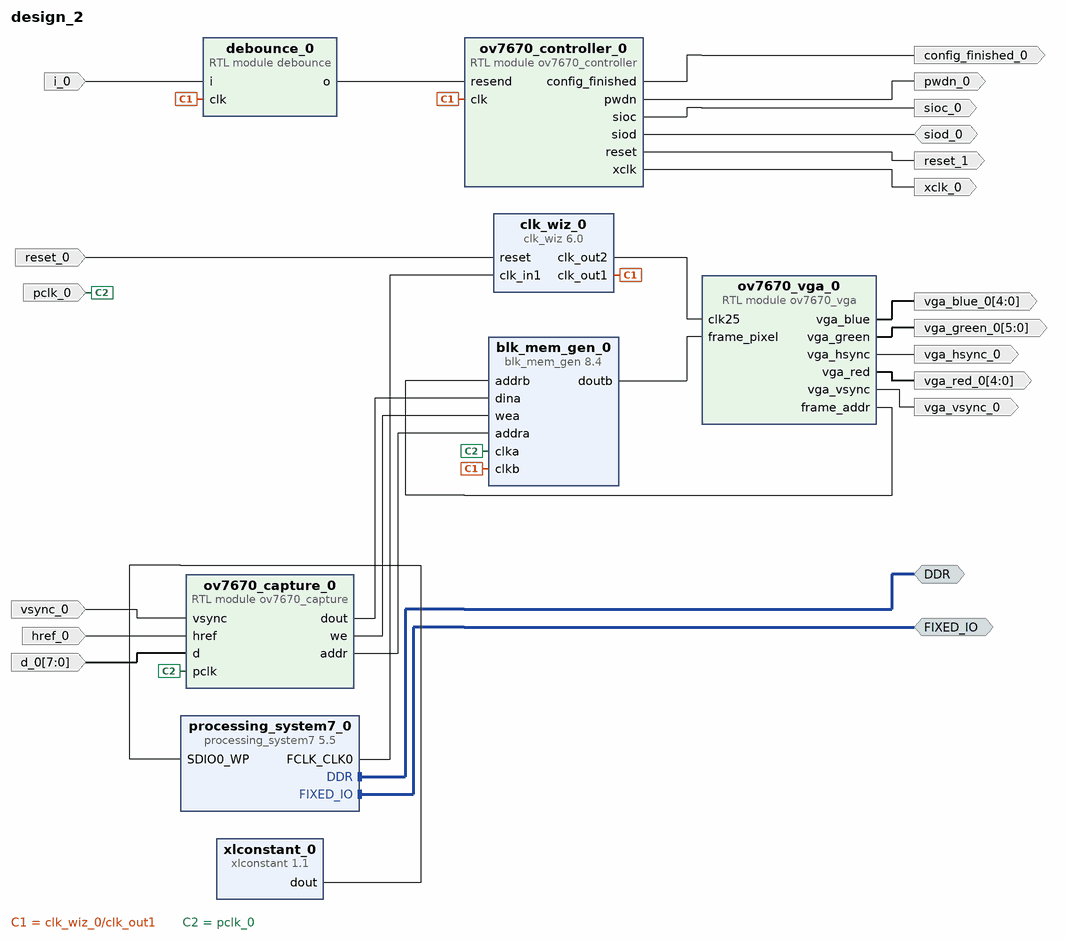
[diagram p0: block diagram of the top level]
# Vivado block design design_2, xc7z010clg400-1, Vivado 2018.3
create_bd_design design_2

create_bd_intf_port -mode Master -vlnv xilinx.com:interface:ddrx_rtl:1.0 DDR
create_bd_intf_port -mode Master -vlnv xilinx.com:display_processing_system7:fixedio_rtl:1.0 FIXED_IO
create_bd_port -dir I pclk_0
create_bd_port -dir I vsync_0
create_bd_port -dir I href_0
create_bd_port -dir I -from 7 -to 0 d_0
create_bd_port -dir I i_0
create_bd_port -dir O -from 4 -to 0 vga_red_0
create_bd_port -dir O -from 5 -to 0 vga_green_0
create_bd_port -dir O -from 4 -to 0 vga_blue_0
create_bd_port -dir O vga_hsync_0
create_bd_port -dir O vga_vsync_0
create_bd_port -dir O config_finished_0
create_bd_port -dir O sioc_0
create_bd_port -dir IO siod_0
create_bd_port -dir O pwdn_0
create_bd_port -dir O xclk_0
create_bd_port -dir I -type rst reset_0
set_property -dict {CONFIG.POLARITY ACTIVE_HIGH} [get_bd_ports reset_0]
create_bd_port -dir O -type rst reset_1

create_bd_cell -type ip -vlnv xilinx.com:ip:processing_system7:5.5 processing_system7_0
set_property -dict [list \
  CONFIG.PCW_APU_PERIPHERAL_FREQMHZ 650 \
  CONFIG.PCW_CRYSTAL_PERIPHERAL_FREQMHZ 50.000000 \
  CONFIG.PCW_ENET0_ENET0_IO {MIO 16 .. 27} \
  CONFIG.PCW_ENET0_GRP_MDIO_ENABLE 1 \
  CONFIG.PCW_ENET0_GRP_MDIO_IO EMIO \
  CONFIG.PCW_ENET0_PERIPHERAL_ENABLE 1 \
  CONFIG.PCW_ENET0_RESET_ENABLE 0 \
  CONFIG.PCW_ENET_RESET_ENABLE 1 \
  CONFIG.PCW_ENET_RESET_SELECT {Share reset pin} \
  CONFIG.PCW_FPGA0_PERIPHERAL_FREQMHZ 100 \
  CONFIG.PCW_GPIO_MIO_GPIO_ENABLE 1 \
  CONFIG.PCW_GPIO_MIO_GPIO_IO MIO \
  CONFIG.PCW_I2C_RESET_ENABLE 1 \
  CONFIG.PCW_PRESET_BANK1_VOLTAGE {LVCMOS 1.8V} \
  CONFIG.PCW_QSPI_GRP_FBCLK_ENABLE 1 \
  CONFIG.PCW_QSPI_GRP_FBCLK_IO {MIO 8} \
  CONFIG.PCW_QSPI_GRP_SINGLE_SS_ENABLE 1 \
  CONFIG.PCW_QSPI_GRP_SINGLE_SS_IO {MIO 1 .. 6} \
  CONFIG.PCW_QSPI_PERIPHERAL_ENABLE 1 \
  CONFIG.PCW_QSPI_QSPI_IO {MIO 1 .. 6} \
  CONFIG.PCW_SD0_GRP_CD_ENABLE 1 \
  CONFIG.PCW_SD0_GRP_CD_IO {MIO 47} \
  CONFIG.PCW_SD0_GRP_WP_ENABLE 1 \
  CONFIG.PCW_SD0_GRP_WP_IO EMIO \
  CONFIG.PCW_SD0_PERIPHERAL_ENABLE 1 \
  CONFIG.PCW_SD0_SD0_IO {MIO 40 .. 45} \
  CONFIG.PCW_SDIO_PERIPHERAL_FREQMHZ 50 \
  CONFIG.PCW_SINGLE_QSPI_DATA_MODE x4 \
  CONFIG.PCW_UART1_PERIPHERAL_ENABLE 1 \
  CONFIG.PCW_UART1_UART1_IO {MIO 48 .. 49} \
  CONFIG.PCW_UART_PERIPHERAL_FREQMHZ 100 \
  CONFIG.PCW_UIPARAM_DDR_FREQ_MHZ 525 \
  CONFIG.PCW_UIPARAM_DDR_PARTNO {MT41K128M16 JT-125} \
  CONFIG.PCW_USB0_PERIPHERAL_ENABLE 1 \
  CONFIG.PCW_USB0_RESET_ENABLE 1 \
  CONFIG.PCW_USB0_RESET_IO {MIO 46} \
  CONFIG.PCW_USB0_USB0_IO {MIO 28 .. 39} \
  CONFIG.PCW_USB_RESET_ENABLE 1 \
  CONFIG.PCW_USB_RESET_SELECT {Share reset pin} \
  CONFIG.PCW_USE_M_AXI_GP0 0 \
] [get_bd_cells processing_system7_0]
# 216 more settings of processing_system7_0 are not shown: defaults, MIO pin electricals, DDR timing, and values the tool derives
create_bd_cell -type ip -vlnv xilinx.com:ip:blk_mem_gen:8.4 blk_mem_gen_0
set_property -dict [list \
  CONFIG.Enable_32bit_Address false \
  CONFIG.Enable_A Always_Enabled \
  CONFIG.Enable_B Always_Enabled \
  CONFIG.Memory_Type Simple_Dual_Port_RAM \
  CONFIG.Operating_Mode_A NO_CHANGE \
  CONFIG.Port_B_Clock 100 \
  CONFIG.Port_B_Enable_Rate 100 \
  CONFIG.Read_Width_B 12 \
  CONFIG.Register_PortB_Output_of_Memory_Primitives true \
  CONFIG.Use_Byte_Write_Enable false \
  CONFIG.Write_Depth_A 153600 \
  CONFIG.Write_Width_A 12 \
  CONFIG.Write_Width_B 12 \
  CONFIG.use_bram_block Stand_Alone \
] [get_bd_cells blk_mem_gen_0]
create_bd_cell -type ip -vlnv xilinx.com:ip:clk_wiz:6.0 clk_wiz_0
set_property -dict [list \
  CONFIG.CLKIN1_JITTER_PS 80.0 \
  CONFIG.CLKOUT1_DRIVES BUFG \
  CONFIG.CLKOUT1_JITTER 124.615 \
  CONFIG.CLKOUT1_PHASE_ERROR 96.948 \
  CONFIG.CLKOUT2_DRIVES BUFG \
  CONFIG.CLKOUT2_JITTER 124.615 \
  CONFIG.CLKOUT2_PHASE_ERROR 96.948 \
  CONFIG.CLKOUT2_USED true \
  CONFIG.CLKOUT3_DRIVES BUFG \
  CONFIG.CLKOUT4_DRIVES BUFG \
  CONFIG.CLKOUT5_DRIVES BUFG \
  CONFIG.CLKOUT6_DRIVES BUFG \
  CONFIG.CLKOUT7_DRIVES BUFG \
  CONFIG.CLK_IN1_BOARD_INTERFACE Custom \
  CONFIG.CLK_IN2_BOARD_INTERFACE Custom \
  CONFIG.ENABLE_CLOCK_MONITOR false \
  CONFIG.FEEDBACK_SOURCE FDBK_AUTO \
  CONFIG.MMCM_CLKFBOUT_MULT_F 8.000 \
  CONFIG.MMCM_CLKIN1_PERIOD 8.000 \
  CONFIG.MMCM_CLKIN2_PERIOD 10.000 \
  CONFIG.MMCM_CLKOUT0_DIVIDE_F 10.000 \
  CONFIG.MMCM_CLKOUT1_DIVIDE 10 \
  CONFIG.MMCM_COMPENSATION ZHOLD \
  CONFIG.MMCM_DIVCLK_DIVIDE 1 \
  CONFIG.NUM_OUT_CLKS 2 \
  CONFIG.PRIMITIVE MMCM \
  CONFIG.PRIM_IN_FREQ 125.000 \
] [get_bd_cells clk_wiz_0]
create_bd_cell -type ip -vlnv xilinx.com:ip:xlconstant:1.1 xlconstant_0
create_bd_cell -type module -reference debounce debounce_0
create_bd_cell -type module -reference ov7670_capture ov7670_capture_0
create_bd_cell -type module -reference ov7670_vga ov7670_vga_0
create_bd_cell -type module -reference ov7670_controller ov7670_controller_0

# ---- connections ----

connect_bd_intf_net [get_bd_intf_ports FIXED_IO] [get_bd_intf_pins processing_system7_0/FIXED_IO]
connect_bd_intf_net [get_bd_intf_ports DDR] [get_bd_intf_pins processing_system7_0/DDR]
connect_bd_net [get_bd_pins clk_wiz_0/clk_out1] [get_bd_pins debounce_0/clk] [get_bd_pins blk_mem_gen_0/clkb] [get_bd_pins ov7670_controller_0/clk]
connect_bd_net [get_bd_pins clk_wiz_0/clk_out2] [get_bd_pins ov7670_vga_0/clk25]
connect_bd_net [get_bd_pins xlconstant_0/dout] [get_bd_pins processing_system7_0/SDIO0_WP]
connect_bd_net [get_bd_pins blk_mem_gen_0/doutb] [get_bd_pins ov7670_vga_0/frame_pixel]
connect_bd_net [get_bd_pins ov7670_capture_0/dout] [get_bd_pins blk_mem_gen_0/dina]
connect_bd_net [get_bd_pins ov7670_capture_0/we] [get_bd_pins blk_mem_gen_0/wea]
connect_bd_net [get_bd_pins ov7670_capture_0/addr] [get_bd_pins blk_mem_gen_0/addra]
connect_bd_net -net pclk_0_1 [get_bd_ports pclk_0] [get_bd_pins ov7670_capture_0/pclk] [get_bd_pins blk_mem_gen_0/clka]
connect_bd_net [get_bd_pins processing_system7_0/FCLK_CLK0] [get_bd_pins clk_wiz_0/clk_in1]
connect_bd_net [get_bd_pins ov7670_vga_0/frame_addr] [get_bd_pins blk_mem_gen_0/addrb]
connect_bd_net -net vsync_0_1 [get_bd_ports vsync_0] [get_bd_pins ov7670_capture_0/vsync]
connect_bd_net -net href_0_1 [get_bd_ports href_0] [get_bd_pins ov7670_capture_0/href]
connect_bd_net -net d_0_1 [get_bd_ports d_0] [get_bd_pins ov7670_capture_0/d]
connect_bd_net -net i_0_1 [get_bd_ports i_0] [get_bd_pins debounce_0/i]
connect_bd_net [get_bd_pins ov7670_vga_0/vga_red] [get_bd_ports vga_red_0]
connect_bd_net [get_bd_pins ov7670_vga_0/vga_green] [get_bd_ports vga_green_0]
connect_bd_net [get_bd_pins ov7670_vga_0/vga_blue] [get_bd_ports vga_blue_0]
connect_bd_net [get_bd_pins ov7670_vga_0/vga_hsync] [get_bd_ports vga_hsync_0]
connect_bd_net [get_bd_pins ov7670_vga_0/vga_vsync] [get_bd_ports vga_vsync_0]
connect_bd_net [get_bd_pins debounce_0/o] [get_bd_pins ov7670_controller_0/resend]
connect_bd_net [get_bd_pins ov7670_controller_0/config_finished] [get_bd_ports config_finished_0]
connect_bd_net [get_bd_pins ov7670_controller_0/sioc] [get_bd_ports sioc_0]
connect_bd_net [get_bd_ports siod_0] [get_bd_pins ov7670_controller_0/siod]
connect_bd_net [get_bd_pins ov7670_controller_0/pwdn] [get_bd_ports pwdn_0]
connect_bd_net [get_bd_pins ov7670_controller_0/xclk] [get_bd_ports xclk_0]
connect_bd_net -net reset_0_1 [get_bd_ports reset_0] [get_bd_pins clk_wiz_0/reset]
connect_bd_net [get_bd_pins ov7670_controller_0/reset] [get_bd_ports reset_1]

validate_bd_design
save_bd_design
